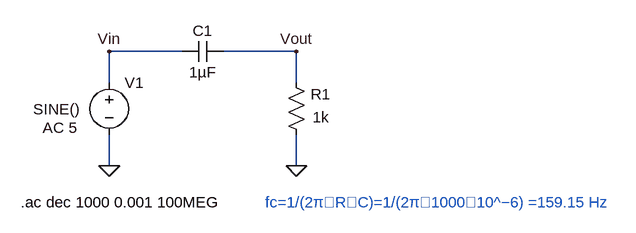
[diagram p0: schematic Highpass Filter.asc]
Highpass Filter.asc, the LTspice schematic file:
Version 4
SHEET 1 972 680
WIRE 80 0 -32 0
WIRE 256 0 144 0
WIRE -32 48 -32 0
WIRE 256 48 256 0
WIRE -32 176 -32 128
WIRE 256 176 256 128
FLAG 256 176 0
FLAG -32 176 0
FLAG -32 0 Vin
FLAG 256 0 Vout
SYMBOL voltage -32 32 R0
WINDOW 3 -117 57 Left 2
WINDOW 123 -102 85 Left 2
WINDOW 39 0 0 Left 0
SYMATTR Value SINE()
SYMATTR Value2 AC 5
SYMATTR InstName V1
SYMBOL res 272 144 R180
WINDOW 0 -37 78 Left 2
WINDOW 3 -35 43 Left 2
SYMATTR InstName R1
SYMATTR Value 1k
SYMBOL cap 144 -16 R90
WINDOW 0 0 32 VBottom 2
WINDOW 3 32 32 VTop 2
SYMATTR InstName C1
SYMATTR Value 1µF
TEXT -168 232 Left 2 !.ac dec 1000 0.001 100MEG
TEXT 208 232 Left 2 ;fc=1/(2π∗R∗C)=1/(2π∗1000∗10^−6) =159.15 Hz

The netlist it stands for:
* Highpass Filter.asc
V1 Vin 0 SINE() AC 5
R1 0 Vout 1k
C1 Vout Vin 1µF
.ac dec 1000 0.001 100MEG
* fc=1/(2π∗R∗C)=1/(2π∗1000∗10^−6) =159.15 Hz
.backanno
.end